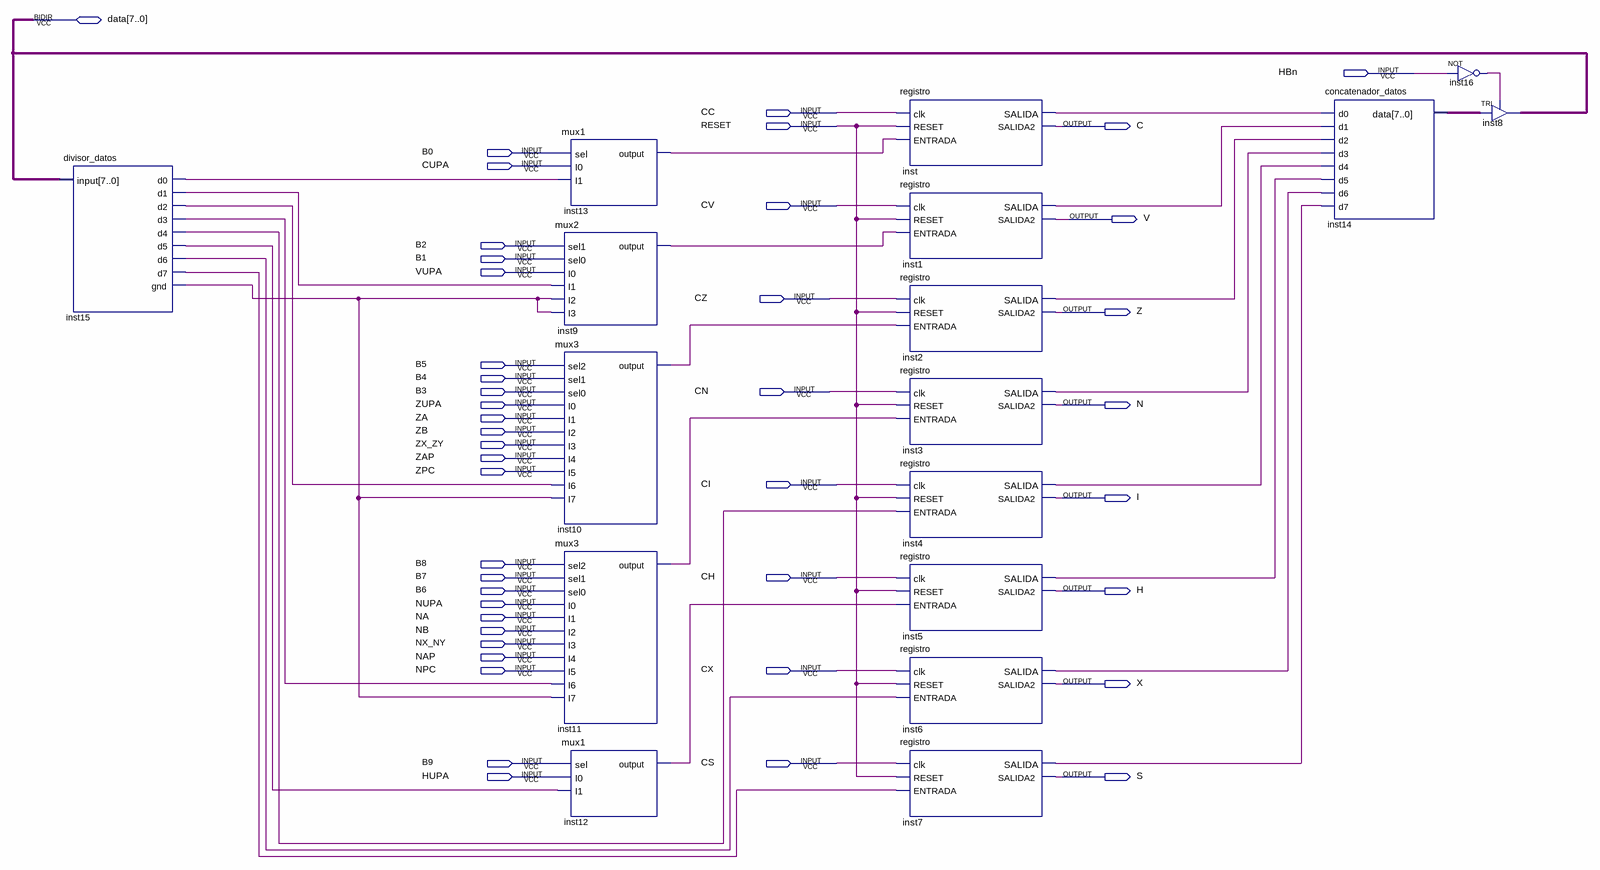
[diagram p0: schematic sheet]
// Quartus schematic Flags.bdf as structural Verilog: 17 symbols, 44 pins
module Flags (
  input  HBn,
  input  CC,
  input  RESET,
  input  B0,
  input  CUPA,
  input  CV,
  input  B2,
  input  B1,
  input  VUPA,
  input  CZ,
  input  B5,
  input  B4,
  input  B3,
  input  CN,
  input  ZUPA,
  input  ZA,
  input  ZB,
  input  ZX_ZY,
  input  ZAP,
  input  ZPC,
  input  CI,
  input  B8,
  input  B7,
  input  CH,
  input  B6,
  input  NUPA,
  input  NA,
  input  NB,
  input  NX_NY,
  input  NAP,
  input  NPC,
  input  CX,
  input  B9,
  input  CS,
  input  HUPA,
  inout  [7:0] data,
  output C,
  output V,
  output Z,
  output N,
  output I,
  output H,
  output X,
  output S
);

  wire inst1_salida, inst2_salida, inst3_salida, inst4_salida, inst5_salida, inst6_salida, inst7_salida,
       inst9_output, inst10_output, inst11_output, inst12_output, inst13_output, inst15_d0, inst15_d1,
       inst15_d2, inst15_d3, inst15_d4, inst15_d5, inst15_d6, inst15_d7, inst15_gnd, inst16_out, inst_salida;
  wire [7:0] inst14_data;

  divisor_datos inst15 (
    .\input (data), .d0(inst15_d0), .d1(inst15_d1), .d2(inst15_d2), .d3(inst15_d3), .d4(inst15_d4),
    .d5(inst15_d5), .d6(inst15_d6), .d7(inst15_d7), .gnd(inst15_gnd));
  mux1 inst13 (.sel(B0), .I0(CUPA), .I1(inst15_d0), .\output (inst13_output));
  mux2 inst9 (
    .sel1(B2), .sel0(B1), .I0(VUPA), .I1(inst15_d1), .I2(inst15_gnd), .I3(inst15_gnd), .\output (inst9_output));
  mux3 inst10 (
    .sel2(B5), .sel1(B4), .sel0(B3), .I0(ZUPA), .I1(ZA), .I2(ZB), .I3(ZX_ZY), .I4(ZAP), .I5(ZPC),
    .I6(inst15_d2), .I7(inst15_gnd), .\output (inst10_output));
  mux3 inst11 (
    .sel2(B8), .sel1(B7), .sel0(B6), .I0(NUPA), .I1(NA), .I2(NB), .I3(NX_NY), .I4(NAP), .I5(NPC),
    .I6(inst15_d3), .I7(inst15_gnd), .\output (inst11_output));
  mux1 inst12 (.sel(B9), .I0(HUPA), .I1(inst15_d5), .\output (inst12_output));
  registro inst (.clk(CC), .RESET(RESET), .ENTRADA(inst13_output), .SALIDA(inst_salida), .SALIDA2(C));
  registro inst1 (.clk(CV), .RESET(RESET), .ENTRADA(inst9_output), .SALIDA(inst1_salida), .SALIDA2(V));
  registro inst2 (.clk(CZ), .RESET(RESET), .ENTRADA(inst10_output), .SALIDA(inst2_salida), .SALIDA2(Z));
  registro inst3 (.clk(CN), .RESET(RESET), .ENTRADA(inst11_output), .SALIDA(inst3_salida), .SALIDA2(N));
  registro inst4 (.clk(CI), .RESET(RESET), .ENTRADA(inst15_d4), .SALIDA(inst4_salida), .SALIDA2(I));
  registro inst5 (.clk(CH), .RESET(RESET), .ENTRADA(inst12_output), .SALIDA(inst5_salida), .SALIDA2(H));
  registro inst6 (.clk(CX), .RESET(RESET), .ENTRADA(inst15_d6), .SALIDA(inst6_salida), .SALIDA2(X));
  registro inst7 (.clk(CS), .RESET(RESET), .ENTRADA(inst15_d7), .SALIDA(inst7_salida), .SALIDA2(S));
  concatenador_datos inst14 (
    .d0(inst_salida), .d1(inst1_salida), .d2(inst2_salida), .d3(inst3_salida), .d4(inst4_salida),
    .d5(inst5_salida), .d6(inst6_salida), .d7(inst7_salida), .data(inst14_data));
  not inst16 (inst16_out, HBn);
  TRI inst8[7:0] (.IN(inst14_data), .OE(inst16_out), .OUT(data));
endmodule
